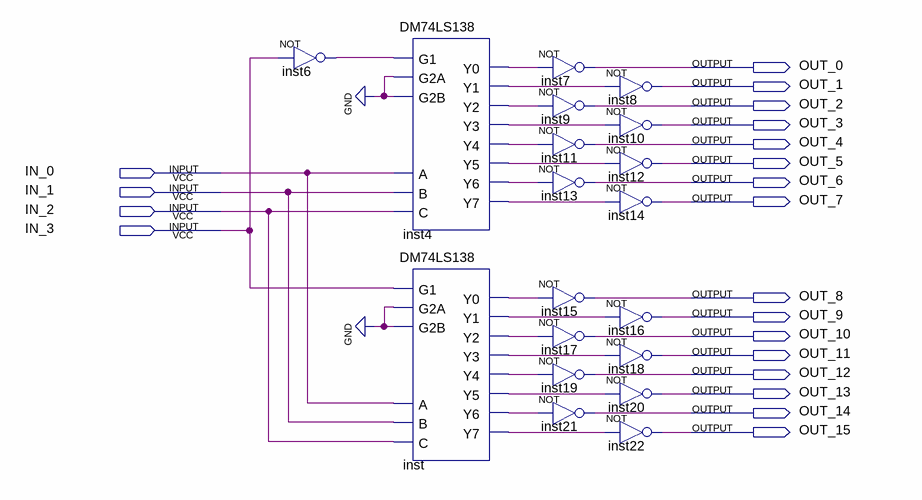
[diagram p0: schematic sheet]
// Quartus schematic DEMUX_4bits.bdf as structural Verilog: 19 symbols, 20 pins
module DEMUX_4bits (
  input  IN_0,
  input  IN_1,
  input  IN_2,
  input  IN_3,
  output OUT_0,
  output OUT_1,
  output OUT_2,
  output OUT_3,
  output OUT_4,
  output OUT_5,
  output OUT_6,
  output OUT_7,
  output OUT_8,
  output OUT_9,
  output OUT_10,
  output OUT_11,
  output OUT_12,
  output OUT_13,
  output OUT_14,
  output OUT_15
);

  wire inst4_y0, inst4_y1, inst4_y2, inst4_y3, inst4_y4, inst4_y5, inst4_y6, inst4_y7, inst6_out, inst_y0,
       inst_y1, inst_y2, inst_y3, inst_y4, inst_y5, inst_y6, inst_y7;

  not inst6 (inst6_out, IN_3);
  DM74LS138 inst4 (
    .G1(inst6_out), .G2A(1'b0), .G2B(1'b0), .A(IN_0), .B(IN_1), .C(IN_2), .Y0(inst4_y0), .Y1(inst4_y1),
    .Y2(inst4_y2), .Y3(inst4_y3), .Y4(inst4_y4), .Y5(inst4_y5), .Y6(inst4_y6), .Y7(inst4_y7));
  DM74LS138 inst (
    .G1(IN_3), .G2A(1'b0), .G2B(1'b0), .A(IN_0), .B(IN_1), .C(IN_2), .Y0(inst_y0), .Y1(inst_y1),
    .Y2(inst_y2), .Y3(inst_y3), .Y4(inst_y4), .Y5(inst_y5), .Y6(inst_y6), .Y7(inst_y7));
  not inst7 (OUT_0, inst4_y0);
  not inst9 (OUT_2, inst4_y2);
  not inst11 (OUT_4, inst4_y4);
  not inst13 (OUT_6, inst4_y6);
  not inst15 (OUT_8, inst_y0);
  not inst17 (OUT_10, inst_y2);
  not inst19 (OUT_12, inst_y4);
  not inst21 (OUT_14, inst_y6);
  not inst8 (OUT_1, inst4_y1);
  not inst10 (OUT_3, inst4_y3);
  not inst12 (OUT_5, inst4_y5);
  not inst14 (OUT_7, inst4_y7);
  not inst16 (OUT_9, inst_y1);
  not inst18 (OUT_11, inst_y3);
  not inst20 (OUT_13, inst_y5);
  not inst22 (OUT_15, inst_y7);
endmodule
